# Altium schematic sheet imp2005.SCHDOC: Imponator 2005
size B; Author: Jon Helge Nistad; DrawnBy: Jon Helge Nistad; Engineer: Jon Helge Nistad; Revision: A; SheetNumber: 1; SheetTotal: 1
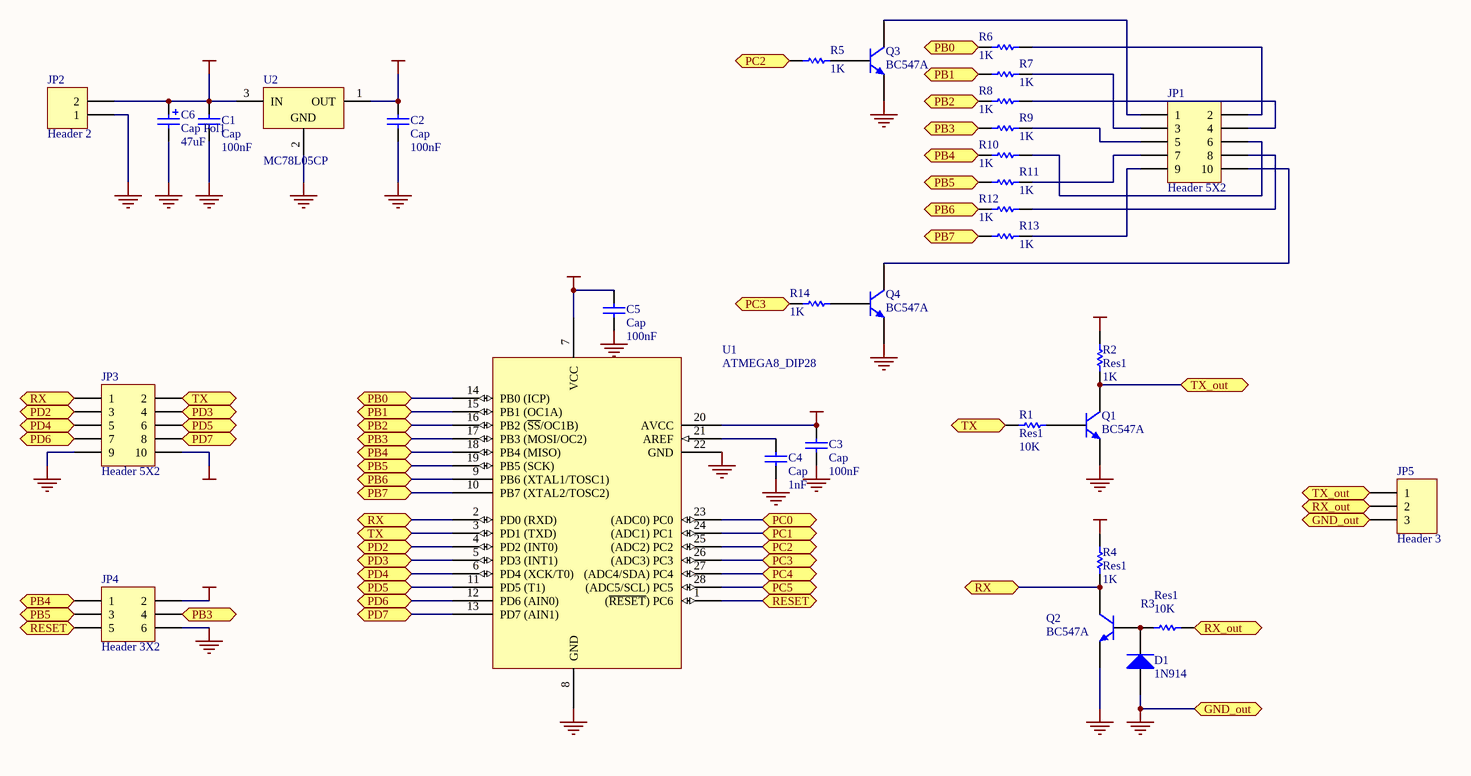
[diagram p0: imp2005.SCHDOC]

## Parts
C1  Cap  value 100nF  [RAD-0.3]
C2  Cap  value 100nF  [RAD-0.3]
C3  Cap  value 100nF  [RAD-0.3]
C4  Cap  value 1nF  [RAD-0.3]
C5  Cap  value 100nF  [RAD-0.3]
C6  Cap Pol1  value 47uF  [RB7.6-15]
D1  1N914  [DIO7.1-3.9x1.9]
JP1  Header 5X2  [HDR2X5]
JP2  Header 2  [HDR1X2]
JP3  Header 5X2  [HDR2X5]
JP4  Header 3X2  [HDR2X3]
JP5  Header 3  [HDR1X3]
Q1  BC547A  [BCY-W3/D5.2]
Q2  BC547A  [BCY-W3/D5.2]
Q3  BC547A  [BCY-W3/D5.2]
Q4  BC547A  [BCY-W3/D5.2]
R1  Res1  value 10K  [AXIAL-0.3]
R2  Res1  value 1K  [AXIAL-0.3]
R3  Res1  value 10K  [AXIAL-0.3]
R4  Res1  value 1K  [AXIAL-0.3]
R5  value 1K  [AXIAL-0.3]
R6  value 1K  [AXIAL-0.3]
R7  value 1K  [AXIAL-0.3]
R8  value 1K  [AXIAL-0.3]
R9  value 1K  [AXIAL-0.3]
R10  value 1K  [AXIAL-0.3]
R11  value 1K  [AXIAL-0.3]
R12  value 1K  [AXIAL-0.3]
R13  value 1K  [AXIAL-0.3]
R14  value 1K  [AXIAL-0.3]
U1  ATMEGA8_DIP28  [DIP-28]
U2  MC78L05CP  [BCY-W3/D5.2]

## Ports
GND_out, PB0, PB1, PB2, PB3, PB4, PB5, PB6, PB7, PC0, PC1, PC2, PC3, PC4, PC5, PD2, PD3, PD4, PD5, PD6, PD7, RESET, RX, RX_out, TX, TX_out

## Nets
9V: C1.2 C6.1 JP2.2 R2.2 R4.1 U2.3(IN)
GND: C1.1 C2.1 C3.1 C4.1 C5.1 C6.2 D1.1(A) JP2.1 JP3.9 JP4.6 JP5.3 Q1.3(E) Q2.3(E) Q3.3(E) Q4.3(E) U1.8(GND) U1.22(GND) U2.2(GND) ; port GND_out
VCC: C2.2 C3.2 C5.2 JP3.10 JP4.2 U1.7(VCC) U1.20(AVCC) U2.1(OUT)
PB0: R6.1 U1.14(PB0_(ICP)) ; port PB0
PB1: R7.1 U1.15(PB1_(OC1A)) ; port PB1
PB2: R8.1 U1.16(PB2_(~{SS}/OC1B)) ; port PB2
PB3: JP4.4 R9.1 U1.17(PB3_(MOSI/OC2)) ; port PB3
PB4: JP4.1 R10.1 U1.18(PB4_(MISO)) ; port PB4
PB5: JP4.3 R11.1 U1.19(PB5_(SCK)) ; port PB5
PB6: R12.1 U1.9(PB6_(XTAL1/TOSC1)) ; port PB6
PB7: R13.1 U1.10(PB7_(XTAL2/TOSC2)) ; port PB7
PC0: U1.23((ADC0)_PC0) ; port PC0
PC1: U1.24((ADC1)_PC1) ; port PC1
PC2: R5.1 U1.25((ADC2)_PC2) ; port PC2
PC3: R14.1 U1.26((ADC3)_PC3) ; port PC3
PC4: U1.27((ADC4/SDA)_PC4) ; port PC4
PC5: U1.28((ADC5/SCL)_PC5) ; port PC5
PD2: JP3.3 U1.4(PD2_(INT0)) ; port PD2
PD3: JP3.4 U1.5(PD3_(INT1)) ; port PD3
PD4: JP3.5 U1.6(PD4_(XCK/T0)) ; port PD4
PD5: JP3.6 U1.11(PD5_(T1)) ; port PD5
PD6: JP3.7 U1.12(PD6_(AIN0)) ; port PD6
PD7: JP3.8 U1.13(PD7_(AIN1)) ; port PD7
RESET: JP4.5 U1.1((~{RESET})_PC6) ; port RESET
RX: JP3.1 Q2.1(C) R4.2 U1.2(PD0_(RXD)) ; port RX
RX_out: JP5.2 R3.1 ; port RX_out
TX: JP3.2 R1.1 U1.3(PD1_(TXD)) ; port TX
TX_out: JP5.1 Q1.1(C) R2.1 ; port TX_out
NetC4_2: C4.2 U1.21(AREF)
NetD1_2: D1.2(K) Q2.2(B) R3.2
NetJP1_1: JP1.1 Q3.1(C)
NetJP1_2: JP1.2 R6.2
NetJP1_3: JP1.3 R7.2
NetJP1_4: JP1.4 R8.2
NetJP1_5: JP1.5 R9.2
NetJP1_6: JP1.6 R10.2
NetJP1_7: JP1.7 R11.2
NetJP1_8: JP1.8 R12.2
NetJP1_9: JP1.9 R13.2
NetJP1_10: JP1.10 Q4.1(C)
NetQ1_2: Q1.2(B) R1.2
NetQ3_2: Q3.2(B) R5.2
NetQ4_2: Q4.2(B) R14.2

## Library data of the parts
C1-C5 = Cap: Capacitor; Manufacturer: Generic Components; Class I: Passive; Published: 8-Jun-2000; Revision: July-2002: Re-released for DXP Platform.; Publisher: Altium Limited; Class II: Capacitor
C6 = Cap Pol1: Polarized Capacitor (Radial); Manufacturer: Generic Components; Class I: Passive; Published: 8-Jun-2000; Revision: July-2002: Re-released for DXP Platform.; Publisher: Altium Limited; Class II: Capacitor
D1 = 1N914: High Conductance Fast Diode; Manufacturer: Fairchild Semiconductor; Revision 1: 11-July-2000: SIM Model Added.; Revision 2: July-2002: Re-released for DXP Platform.; Class I: Discrete; Class II: Diode - Switching; Published: 8-Jun-2000; Datasheet: Latest Revision: 1997; Package Reference: DO-35; Publisher: Altium Limited
JP1 JP3 = Header 5X2: Header, 5-Pin, Dual row; Manufacturer: Generic Components; Class I: Connector; Revision: July-2002: Re-released for DXP Platform.; Publisher: Altium Limited
JP2 = Header 2: Header, 2-Pin; Manufacturer: Generic Components; Class I: Connector; Revision: July-2002: Re-released for DXP Platform.; Publisher: Altium Limited
JP4 = Header 3X2: Header, 3-Pin, Dual row; Manufacturer: Generic Components; Class I: Connector; Revision: July-2002: Re-released for DXP Platform.; Publisher: Altium Limited
JP5 = Header 3: Header, 3-Pin; Manufacturer: Generic Components; Class I: Connector; Revision: July-2002: Re-released for DXP Platform.; Publisher: Altium Limited
Q1-Q4 = BC547A: Amplifier Transistor NPN Silicon; Manufacturer: Motorola; Package Information: Latest Revision: 1996; Class I: Discrete; Class II: BJT - Low Power; Published: 29-Sep-2000; Revision: July-2002: Re-released for DXP Platform.; Datasheet: Small Signal Transistors, FETs and Diodes, DL126 Rev3 (1991); Package Reference: 29-04; Publisher: Altium Limited
R1-R14 = Res1: Resistor; Manufacturer: Generic Components; Class I: Passive; Published: 8-Jun-2000; Revision: July-2002: Re-released for DXP Platform.; Publisher: Altium Limited; Class II: Resistor
U1 = ATMEGA8_DIP28: Atmel Microcontroller - Library created by carel..  <www.mpfreezone.com>
U2 = MC78L05CP: 3-Terminal Low-Current Positive Fixed Voltage Regulator; Manufacturer: Motorola; Package Information: Latest Revision: 1996; Class I: Power Management; Published: 15-Apr-2002; Datasheet: Linear and Interface Integrated Circuits, DL128 Rev2 (1988); Package Reference: 29-04; Publisher: Altium Limited; Class II: Voltage Regulator